# Altium project Grabber_DIOT.PrjPCB (part 2 of 2)

## Sheet EEM_Connectors.SchDoc: Grabber_DIOT
size 420 x 297 mm; DrawnBy: MMroz; Address1: Warsaw Univeristy of Technology; Address2: Nowowiejska 15/19; Revision: 0.1; SheetNumber: 4; SheetTotal: 5; SPICEModelCacheUDDSOIAX: <root> / <DocumentId>UDDSOIAX</DocumentId> / </root>; Title2: EEM_Connectors
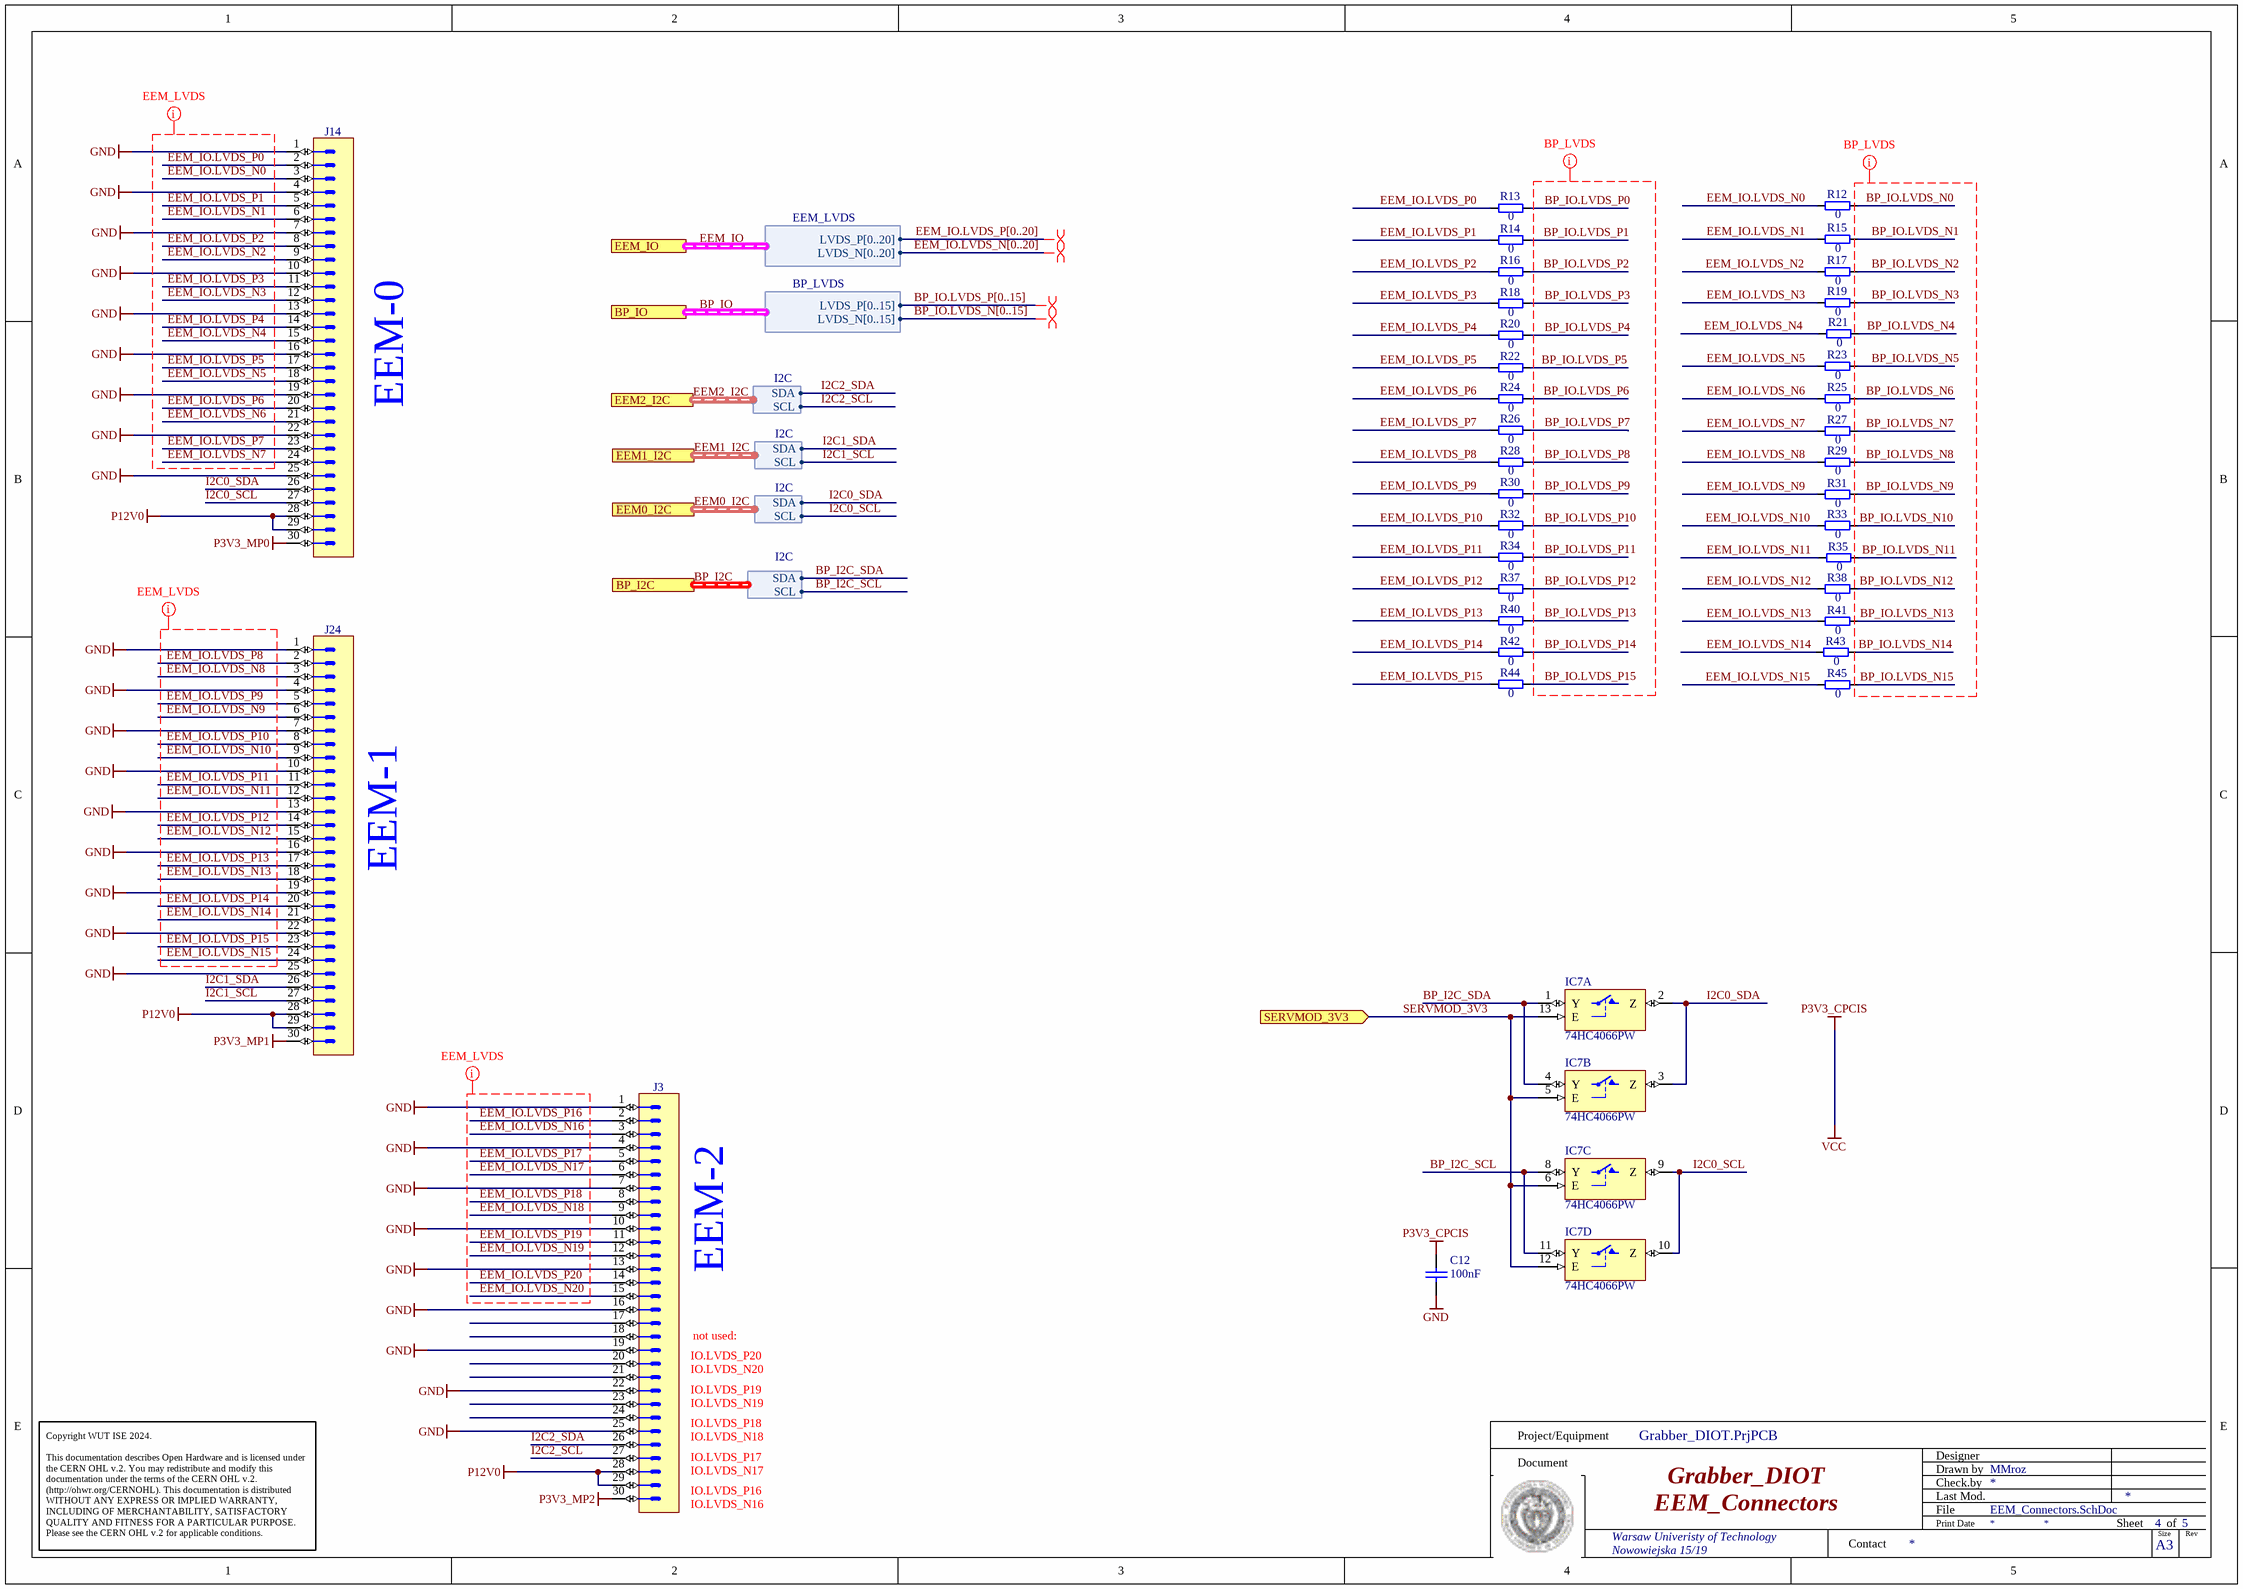
[diagram p4: EEM_Connectors.SchDoc]

### Parts
C12  100nF  [CAPC1608X87N]
IC7  74HC4066PW  [SOP65P640X110-14N]  (parts A,B,C,D of 4)
J3  N2530-6002RB  [3M_N2530-6002RB]  (value not drawn)
J14  N2530-6002RB  [3M_N2530-6002RB]  (value not drawn)
J24  N2530-6002RB  [3M_N2530-6002RB]  (value not drawn)
R12  0  [RESC1005X40N]
R13  0  [RESC1005X40N]
R14  0  [RESC1005X40N]
R15  0  [RESC1005X40N]
R16  0  [RESC1005X40N]
R17  0  [RESC1005X40N]
R18  0  [RESC1005X40N]
R19  0  [RESC1005X40N]
R20  0  [RESC1005X40N]
R21  0  [RESC1005X40N]
R22  0  [RESC1005X40N]
R23  0  [RESC1005X40N]
R24  0  [RESC1005X40N]
R25  0  [RESC1005X40N]
R26  0  [RESC1005X40N]
R27  0  [RESC1005X40N]
R28  0  [RESC1005X40N]
R29  0  [RESC1005X40N]
R30  0  [RESC1005X40N]
R31  0  [RESC1005X40N]
R32  0  [RESC1005X40N]
R33  0  [RESC1005X40N]
R34  0  [RESC1005X40N]
R35  0  [RESC1005X40N]
R37  0  [RESC1005X40N]
R38  0  [RESC1005X40N]
R40  0  [RESC1005X40N]
R41  0  [RESC1005X40N]
R42  0  [RESC1005X40N]
R43  0  [RESC1005X40N]
R44  0  [RESC1005X40N]
R45  0  [RESC1005X40N]

### Ports
BP_I2C (harness I2C), BP_IO (harness BP_LVDS), EEM0_I2C (harness I2C), EEM1_I2C (harness I2C), EEM2_I2C (harness I2C), EEM_IO (harness EEM_LVDS), SERVMOD_3V3 (in)

### Harnesses
EEM_LVDS: LVDS_P[0..20], LVDS_N[0..20]
BP_LVDS: LVDS_P[0..15], LVDS_N[0..15]
I2C: SDA, SCL

### Nets
GND: C12.1 IC7.7(GND) J3.1 J3.4 J3.7 J3.10 J3.13 J3.16 J3.19 J3.22 J3.25 J14.1 J14.4 J14.7 J14.10 J14.13 J14.16 J14.19 J14.22 J14.25 J24.1 J24.4 J24.7 J24.10 J24.13 J24.16 J24.19 J24.22 J24.25
P3V3_CPCIS: C12.2 IC7.14(VCC)  [also labelled VCC]
P3V3_MP0: J14.30
P3V3_MP1: J24.30
P3V3_MP2: J3.30
P12V0: J3.28 J3.29 J14.28 J14.29 J24.28 J24.29
BP_I2C_SCL: IC7.8(Y) IC7.11(Y) ; port BP_I2C.SCL  [project net BP_I2C.SCL]
BP_I2C_SDA: IC7.1(Y) IC7.4(Y) ; port BP_I2C.SDA  [project net BP_I2C.SDA]
BP_IO.LVDS_N0: R12.2
BP_IO.LVDS_N1: R15.2
BP_IO.LVDS_N2: R17.2
BP_IO.LVDS_N3: R19.2
BP_IO.LVDS_N4: R21.2
BP_IO.LVDS_N5: R23.2
BP_IO.LVDS_N6: R25.2
BP_IO.LVDS_N7: R27.2
BP_IO.LVDS_N8: R29.2
BP_IO.LVDS_N9: R31.2
BP_IO.LVDS_N10: R33.2
BP_IO.LVDS_N11: R35.2
BP_IO.LVDS_N12: R38.2
BP_IO.LVDS_N13: R41.2
BP_IO.LVDS_N14: R43.2
BP_IO.LVDS_N15: R45.2
BP_IO.LVDS_P0: R13.2
BP_IO.LVDS_P1: R14.2
BP_IO.LVDS_P2: R16.2
BP_IO.LVDS_P3: R18.2
BP_IO.LVDS_P4: R20.2
BP_IO.LVDS_P5: R22.2
BP_IO.LVDS_P6: R24.2
BP_IO.LVDS_P7: R26.2
BP_IO.LVDS_P8: R28.2
BP_IO.LVDS_P9: R30.2
BP_IO.LVDS_P10: R32.2
BP_IO.LVDS_P11: R34.2
BP_IO.LVDS_P12: R37.2
BP_IO.LVDS_P13: R40.2
BP_IO.LVDS_P14: R42.2
BP_IO.LVDS_P15: R44.2
EEM_IO.LVDS_N0: J14.3 R12.1
EEM_IO.LVDS_N1: J14.6 R15.1
EEM_IO.LVDS_N2: J14.9 R17.1
EEM_IO.LVDS_N3: J14.12 R19.1
EEM_IO.LVDS_N4: J14.15 R21.1
EEM_IO.LVDS_N5: J14.18 R23.1
EEM_IO.LVDS_N6: J14.21 R25.1
EEM_IO.LVDS_N7: J14.24 R27.1
EEM_IO.LVDS_N8: J24.3 R29.1
EEM_IO.LVDS_N9: J24.6 R31.1
EEM_IO.LVDS_N10: J24.9 R33.1
EEM_IO.LVDS_N11: J24.12 R35.1
EEM_IO.LVDS_N12: J24.15 R38.1
EEM_IO.LVDS_N13: J24.18 R41.1
EEM_IO.LVDS_N14: J24.21 R43.1
EEM_IO.LVDS_N15: J24.24 R45.1
EEM_IO.LVDS_N16: J3.3
EEM_IO.LVDS_N17: J3.6
EEM_IO.LVDS_N18: J3.9
EEM_IO.LVDS_N19: J3.12
EEM_IO.LVDS_N20: J3.15
EEM_IO.LVDS_P0: J14.2 R13.1
EEM_IO.LVDS_P1: J14.5 R14.1
EEM_IO.LVDS_P2: J14.8 R16.1
EEM_IO.LVDS_P3: J14.11 R18.1
EEM_IO.LVDS_P4: J14.14 R20.1
EEM_IO.LVDS_P5: J14.17 R22.1
EEM_IO.LVDS_P6: J14.20 R24.1
EEM_IO.LVDS_P7: J14.23 R26.1
EEM_IO.LVDS_P8: J24.2 R28.1
EEM_IO.LVDS_P9: J24.5 R30.1
EEM_IO.LVDS_P10: J24.8 R32.1
EEM_IO.LVDS_P11: J24.11 R34.1
EEM_IO.LVDS_P12: J24.14 R37.1
EEM_IO.LVDS_P13: J24.17 R40.1
EEM_IO.LVDS_P14: J24.20 R42.1
EEM_IO.LVDS_P15: J24.23 R44.1
EEM_IO.LVDS_P16: J3.2
EEM_IO.LVDS_P17: J3.5
EEM_IO.LVDS_P18: J3.8
EEM_IO.LVDS_P19: J3.11
EEM_IO.LVDS_P20: J3.14
I2C0_SCL: IC7.9(Z) IC7.10(Z) J14.27 ; port EEM0_I2C.SCL  [project net EEM0_I2C.SCL]
I2C0_SDA: IC7.2(Z) IC7.3(Z) J14.26 ; port EEM0_I2C.SDA  [project net EEM0_I2C.SDA]
I2C1_SCL: J24.27 ; port EEM1_I2C.SCL  [project net EEM1_I2C.SCL]
I2C1_SDA: J24.26 ; port EEM1_I2C.SDA  [project net EEM1_I2C.SDA]
I2C2_SCL: J3.27 ; port EEM2_I2C.SCL  [project net EEM2_I2C.SCL]
I2C2_SDA: J3.26 ; port EEM2_I2C.SDA  [project net EEM2_I2C.SDA]
SERVMOD_3V3: IC7.5(E) IC7.6(E) IC7.12(E) IC7.13(E) ; port SERVMOD_3V3

Not connected (* = marked no-connect by the designer): J3 17 18 20 21 23 24

### Buses and harness runs
bus BP_IO.LVDS_N[0..15]
bus BP_IO.LVDS_P[0..15]
bus EEM_IO.LVDS_N[0..20]
bus EEM_IO.LVDS_P[0..20]
harness BP_I2C = port BP_I2C
harness BP_IO = port BP_IO
harness EEM0_I2C = port EEM0_I2C
harness EEM1_I2C = port EEM1_I2C
harness EEM2_I2C = port EEM2_I2C
harness EEM_IO = port EEM_IO

### Layout directives
differential pair; differential pair class Diff_100Ohm: (no net found under the mark)
net class EEM_LVDS: EEM_IO.LVDS_N0, EEM_IO.LVDS_N1, EEM_IO.LVDS_N2, EEM_IO.LVDS_N3, EEM_IO.LVDS_N4, EEM_IO.LVDS_N5, EEM_IO.LVDS_N6, EEM_IO.LVDS_N7, EEM_IO.LVDS_N8, EEM_IO.LVDS_N9, EEM_IO.LVDS_N10, EEM_IO.LVDS_N11, EEM_IO.LVDS_N12, EEM_IO.LVDS_N13, EEM_IO.LVDS_N14, EEM_IO.LVDS_N15, EEM_IO.LVDS_N16, EEM_IO.LVDS_N17, EEM_IO.LVDS_N18, EEM_IO.LVDS_N19, EEM_IO.LVDS_N20, EEM_IO.LVDS_P0, EEM_IO.LVDS_P1, EEM_IO.LVDS_P2, EEM_IO.LVDS_P3, EEM_IO.LVDS_P4, EEM_IO.LVDS_P5, EEM_IO.LVDS_P6, EEM_IO.LVDS_P7, EEM_IO.LVDS_P8, EEM_IO.LVDS_P9, EEM_IO.LVDS_P10, EEM_IO.LVDS_P11, EEM_IO.LVDS_P12, EEM_IO.LVDS_P13, EEM_IO.LVDS_P14, EEM_IO.LVDS_P15, EEM_IO.LVDS_P16, EEM_IO.LVDS_P17, EEM_IO.LVDS_P18, EEM_IO.LVDS_P19, EEM_IO.LVDS_P20
net class BP_LVDS: BP_IO.LVDS_N0, BP_IO.LVDS_N1, BP_IO.LVDS_N2, BP_IO.LVDS_N3, BP_IO.LVDS_N4, BP_IO.LVDS_N5, BP_IO.LVDS_N6, BP_IO.LVDS_N7, BP_IO.LVDS_N8, BP_IO.LVDS_N9, BP_IO.LVDS_N10, BP_IO.LVDS_N11, BP_IO.LVDS_N12, BP_IO.LVDS_N13, BP_IO.LVDS_N14, BP_IO.LVDS_N15, BP_IO.LVDS_P0, BP_IO.LVDS_P1, BP_IO.LVDS_P2, BP_IO.LVDS_P3, BP_IO.LVDS_P4, BP_IO.LVDS_P5, BP_IO.LVDS_P6, BP_IO.LVDS_P7, BP_IO.LVDS_P8, BP_IO.LVDS_P9, BP_IO.LVDS_P10, BP_IO.LVDS_P11, BP_IO.LVDS_P12, BP_IO.LVDS_P13, BP_IO.LVDS_P14, BP_IO.LVDS_P15

### Notes on the sheet
- (near J14) EEM-0
- (near J24) EEM-1
- (near J3) EEM-2
- not used:
- (near J3) IO.LVDS_P20
- (near J3) IO.LVDS_N20
- (near J3) IO.LVDS_P19
- (near J3) IO.LVDS_N19
- (near J3) IO.LVDS_P18
- (near J3) IO.LVDS_N18
- (near J3) IO.LVDS_P17
- (near J3) IO.LVDS_N17
- (near J3) IO.LVDS_P16
- (near J3) IO.LVDS_N16
- Project/Equipment
- Document
- Designer
- Drawn by
- Check.by
- Copyright WUT ISE 2024.
  This documentation describes Open Hardware and is licensed under the CERN OHL v.2. You may redistribute and modify this documentation under the terms of the CERN OHL v.2. (http://ohwr.org/CERNOHL). This documentation is distributed WITHOUT ANY EXPRESS OR IMPLIED WARRANTY, INCLUDING OF MERCHANTABILITY, SATISFACTORY QUALITY AND FITNESS FOR A PARTICULAR PURPOSE. Please see the CERN OHL v.2 for applicable conditions.
- Contact
- File
- Last Mod.
- Print Date
- Sheet
- Size
- A3
- of
- Rev

### Library data of the parts
C12 = CC0603_100NF_50V_10%_X7R: Non-polarised capacitor; Part Description: SMD Multilayer Chip Ceramic Capacitor; Manufacturer: GENERIC; Manufacturer1 Part Number: 223858615649; Voltage: 50V; TC: X7R; Tolerance: ±10%; Part Number: CC0603_100NF_50V_10%_X7R; Component Kind: Standard; Component Type: Standard; Pin Count: 2; Value: 100nF; Status: Preferred; Manufacturer Part Number: CC0603_100NF_50V_10%_X7R; Case: 0603; Mounted: Yes; Socket: No; SMD: Yes; Sense: No; Manufacturer1 Example: PHYCOMP; Manufacturer1 ComponentHeight: 0.87mm; HelpURL: \\cern.ch\dfs\Applications\Altium\Datasheets\CC0603_X7R_PHYCOMP.pdf; Author: CERN DEM JLC; CreateDate: 03.12.2007; LatestRevisionDate: 03.12.2007
IC7 = 74HC4066PW: Part Description: Quad Single-Pole Single-Throw Analog Switch; Manufacturer: NXP SEMICONDUCTORS; PressFit: No; Bonding: No; Part Number: 74HC4066PW; Component Kind: Standard; Component Type: Standard; Device: 74HC4066PW; PackageDescription: SOP, 0.65mm Pitch; 14 Pin, 4.40mm W X 5.00mm L X 1.20mm H body, IPC Medium Density; Manufacturer Part Number: 74HC4066PW; Pin Count: 14; Case: TSSOP14; Mounted: Yes; Socket: No; SMD: Yes; Sense: No; ComponentHeight: 1.1mm; Author: CERN DEM JLC; HelpURL: \\cern.ch\dfs\Applications\Altium\Datasheets\74HC4066PW.pdf; CreateDate: 19.11.2014; LatestRevisionDate: 19.11.2014
J3 J14 J24 = 3M_N2530-6002RB: 30 Contacts - Straight .100'' x .100'' Low Profile Four-Wall Header, 2500 Series; Manufacturer: 3M; PressFit: No; Part Number: 3M_N2530-6002RB; Component Kind: Standard; Component Type: Standard; Pin Count: 30; Family: Header 30; Mounted: Yes; Socket: No; SMD: No; Sense: No; Status: None; Part Description: 30 Contacts - Straight .100'' x .100'' Low Profile Four-Wall Header, 2500 Series; Manufacturer Part Number: N2530-6002RB; ComponentHeight: 10.03mm; HelpURL: \\cern.ch\dfs\Applications\Altium\Datasheets\3M_N2530-6002RB.pdf; Author: CERN DEM JLC; CreateDate: 11.02.2009; LatestRevisionDate: 11.08.2009
R12-R35 R37 R38 R40-R45 = R0402_0R_JUMPER: Resistor; Part Description: 1A (0.05R Max DC Resistance) Zero Ohm Jumper; Manufacturer: GENERIC; Manufacturer1 Part Number: 232270591001L; Part Number: R0402_0R_JUMPER; Component Kind: Standard; Component Type: Standard; Pin Count: 2; Value: 0; Status: Not recommended; Manufacturer Part Number: R0402_0R_JUMPER; Case: 0402; Mounted: Yes; Sense: No; Socket: No; SMD: Yes; Manufacturer1 Example: YAGEO PHYCOMP; Manufacturer1 ComponentHeight: 0.4mm; HelpURL: \\cern.ch\dfs\Applications\Altium\Datasheets\R0402_Phycomp_RC0402.pdf; Author: CERN DEM JLC; CreateDate: 03.12.2007; LatestRevisionDate: 17.10.2012

## Sheet Supply.SchDoc
size A4
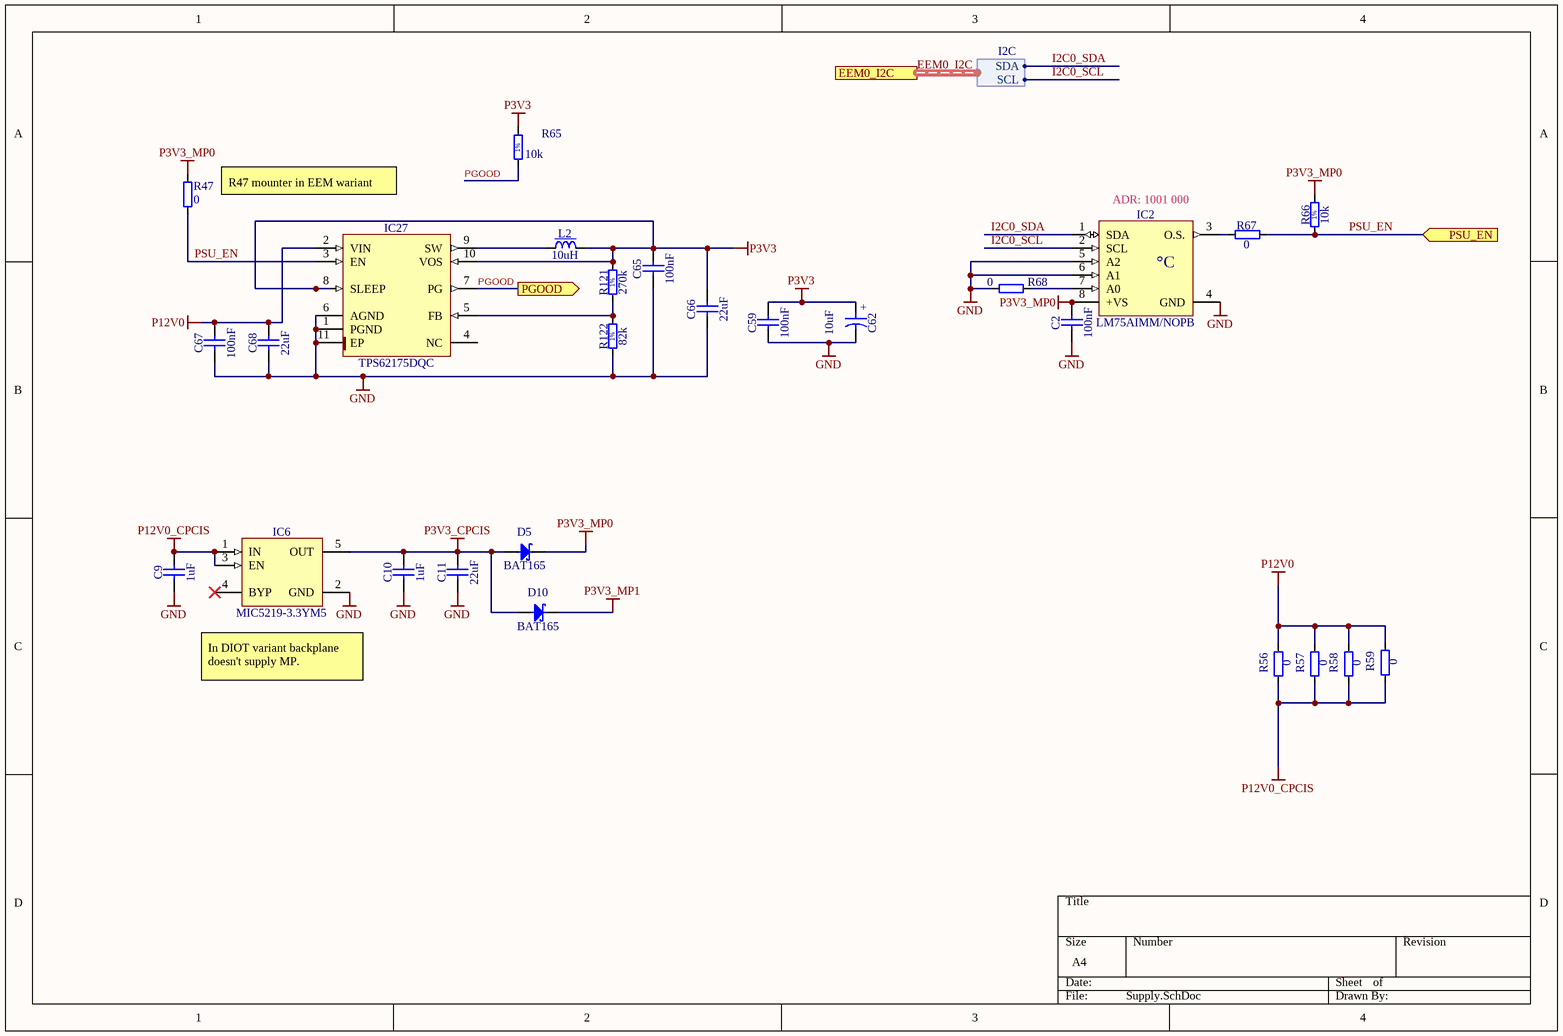
[diagram p5: Supply.SchDoc]

### Parts
C2  100nF  [CAPC1005X55N]
C9  1uF  [CAPC1608X87N]
C10  1uF  [CAPC1608X87N]
C11  22uF  [CAPC1608X90N]
C59  100nF  [CAPC1005X55N]
C62  10uF  [CAPAE430X540N]
C65  100nF  [CAPC1005X55N]
C66  22uF  [CAPC2012X135N]
C67  100nF  [CAPC1005X55N]
C68  22uF  [CAPC2012X135N]
D5  BAT165  [SOD2512X110N]
D10  BAT165  [SOD2512X110N]
IC2  LM75AIMM/NOPB  [SOP65P490X109-8N]
IC6  MIC5219-3.3YM5  [SOT95P280X145-5N]
IC27  TPS62175DQC  [SON50P200X300X80-11N-R94X250]
L2  10uH  [IND_MURATA-PS_8400]
R47  0  [RESC1005X40N]
R56  0  [RESC1005X35N]
R57  0  [RESC1005X35N]
R58  0  [RESC1005X35N]
R59  0  [RESC1005X35N]
R65  10k  [RESC1005X40N]
R66  10k  [RESC1005X40N]
R67  0  [RESC1005X35N]
R68  0  [RESC1005X35N]
R121  270k  [RESC1608X55N]
R122  82k  [RESC1608X55N]

### Ports
EEM0_I2C (harness I2C), PGOOD (out), PSU_EN (in)

### Harnesses
I2C: SDA, SCL

### Nets
GND: C2.1 C9.1 C10.1 C11.1 C59.1 C62.2 C65.1 C66.1 C67.1 C68.1 IC2.4(GND) IC2.5(A2) IC2.6(A1) IC6.2(GND) IC27.1(PGND) IC27.6(AGND) IC27.11(EP) R68.1 R122.1
P3V3: C59.2 C62.1 C65.2 C66.2 IC27.8(SLEEP) IC27.10(VOS) L2.2 R65.2 R121.2
P3V3_CPCIS: C10.2 C11.2 D5.2(A) D10.2(A) IC6.5(OUT)
P3V3_MP0: C2.2 D5.1(C) IC2.8(+VS) R47.2 R66.2
P3V3_MP1: D10.1(C)
P12V0: C67.2 C68.2 IC27.2(VIN) R56.1 R57.1 R58.1 R59.1
P12V0_CPCIS: C9.2 IC6.1(IN) IC6.3(EN) R56.2 R57.2 R58.2 R59.2
I2C0_SCL: IC2.2(SCL) ; port EEM0_I2C.SCL  [project net EEM0_I2C.SCL]
I2C0_SDA: IC2.1(SDA) ; port EEM0_I2C.SDA  [project net EEM0_I2C.SDA]
PGOOD: IC27.7(PG) R65.1 ; port PGOOD
PSU_EN: IC27.3(EN) R47.1 R66.1 R67.2 ; port PSU_EN
NetIC2_3: IC2.3(O.S.) R67.1
NetIC2_7: IC2.7(A0) R68.2
NetIC27_5: IC27.5(FB) R121.1 R122.2
NetIC27_9: IC27.9(SW) L2.1

Not connected (* = marked no-connect by the designer): IC6 4(BYP)*; IC27 4(NC)

### Buses and harness runs
harness EEM0_I2C = port EEM0_I2C

### Notes on the sheet
- R47 mounter in EEM wariant
- (near IC2) ADR: 1001 000
- In DIOT variant backplane doesn't supply MP.
- (in symbol CAE430-540_10UF_16V_20%) +
- (in symbol LM75AIMM/NOPB) °C
- (in symbol R0402_10K_1%_0.0625W_100PPM) 1%
- (in symbol R0603_82K_1%_0.1W_100PPM) 1%
- (in symbol R0603_270K_1%_0.1W_100PPM) 1%

### Library data of the parts
C2 C59 C65 C67 = CC0402_100NF_16V_10%_X5R: Non-polarised capacitor; Part Description: SMD Multilayer Chip Ceramic Capacitor; Manufacturer: GENERIC; Manufacturer1 Part Number: GRM155R61C104KA88D; Voltage: 16V; TC: X5R; Tolerance: ±10%; Part Number: CC0402_100NF_16V_10%_X5R; Component Kind: Standard; Component Type: Standard; Pin Count: 2; Value: 100nF; Status: None; Manufacturer Part Number: CC0402_100NF_16V_10%_X5R; Case: 0402; Mounted: Yes; Socket: No; SMD: Yes; Sense: No; Manufacturer1 Example: MURATA; Manufacturer1 ComponentHeight: 0.55mm; HelpURL: \\cern.ch\dfs\Applications\Altium\Datasheets\CC0402_X5R_MURATA_GRM.pdf; Author: CERN DEM JLC; CreateDate: 10.12.2013; LatestRevisionDate: 10.12.2013
C9 C10 = CC0603_1UF_25V_10%_X7R: Non-polarised capacitor; Part Description: SMD Multilayer Chip Ceramic Capacitor; Manufacturer: GENERIC; Manufacturer1 Part Number: GRM188R71E105KA12D; Voltage: 25V; TC: X7R; Tolerance: ±10%; Part Number: CC0603_1UF_25V_10%_X7R; Component Kind: Standard; Component Type: Standard; Pin Count: 2; Value: 1uF; Status: None; Manufacturer Part Number: CC0603_1UF_25V_10%_X7R; Case: 0603; Mounted: Yes; Socket: No; SMD: Yes; Sense: No; Manufacturer1 Example: MURATA; Manufacturer1 ComponentHeight: 0.9mm; HelpURL: \\cern.ch\dfs\Applications\Altium\Datasheets\CC0603_X7R_MURATA.pdf; Author: CERN DEM JLC; CreateDate: 18.01.2011; LatestRevisionDate: 18.01.2011
C11 = CC0603_22UF_6.3V_20%_X5R: Non-polarised capacitor; Part Description: SMD Multilayer Chip Ceramic Capacitor; Manufacturer: GENERIC; Manufacturer1 Part Number: C1608X5R0J226M080; Voltage: 6.3V; TC: X5R; Tolerance: ±20%; Part Number: CC0603_22UF_6.3V_20%_X5R; Component Kind: Standard; Component Type: Standard; Pin Count: 2; Value: 22uF; Status: None; Manufacturer Part Number: CC0603_22UF_6.3V_20%_X5R; Case: 0603; Mounted: Yes; Socket: No; SMD: Yes; Sense: No; Manufacturer1 Example: TDK; Manufacturer1 ComponentHeight: 0.9mm; HelpURL: \\cern.ch\dfs\Applications\Altium\Datasheets\CC0603_X5R_TDK_C.pdf; Author: CERN DEM JLC; CreateDate: 16.12.2013; LatestRevisionDate: 03.12.2020
C62 = CAE430-540_10UF_16V_20%: Polarised capacitor; Part Description: Aluminum Electrolytic SMT Capacitor; Manufacturer: PANASONIC; Manufacturer Part Number: EEEFK1C100AR; Voltage: 16V; Tolerance: ±20%; Part Number: CAE430-540_10UF_16V_20%; Component Kind: Standard; Component Type: Standard; Pin Count: 2; Value: 10uF; Status: Not Recommended; Case: B; Mounted: Yes; Socket: No; SMD: Yes; Sense: No; ComponentHeight: 5.8mm; HelpURL: \\cern.ch\dfs\Applications\Altium\Datasheets\CAE_PANASONIC_FK.pdf; Author: CERN DEM JLC; CreateDate: 03.12.2007; LatestRevisionDate: 05.11.2014
C66 C68 = CC0805_22UF_16V_10%_X5R: Non-polarised capacitor; Part Description: SMD Multilayer Chip Ceramic Capacitor; Manufacturer: GENERIC; Manufacturer1 Part Number: C2012X5R1C226KT; Voltage: 16V; TC: X5R; Tolerance: ±10%; Part Number: CC0805_22UF_16V_10%_X5R; Component Kind: Standard; Component Type: Standard; Pin Count: 2; Value: 22uF; Status: Preferred; Manufacturer Part Number: CC0805_22UF_16V_10%_X5R; Case: 0805; Mounted: Yes; Socket: No; SMD: Yes; Sense: No; Manufacturer1 Example: TDK; Manufacturer1 ComponentHeight: 1.35mm; HelpURL: \\cern.ch\dfs\Applications\Altium\Datasheets\CC0805_X5R_TDK_C.pdf; Author: CERN DEM JLC; CreateDate: 25.10.2012; LatestRevisionDate: 25.10.2012
D5 D10 = BAT165: Schottky Diode; Manufacturer: INFINEON; Part Description: Medium Power AF Schottky Diode; Voltage: 40V; Power: 750mA; PressFit: No; Bonding: No; Manufacturer Part Number: BAT165; PackageDescription: Small Outline Diode (SOD-323), 1.70mm W X 1.25mm L X 1.10mm H body,  IPC Medium Density; Part Number: BAT165; Component Kind: Standard; Component Type: Standard; Device: BAT165; Pin Count: 2; Case: SOD323; Mounted: Yes; Socket: No; SMD: Yes; Sense: No; ComponentHeight: 1.1mm; HelpURL: \\cern.ch\dfs\Applications\Altium\Datasheets\BAT165.pdf; Author: CERN DEM JLC; CreateDate: 12.11.2014; LatestRevisionDate: 12.11.2014
IC2 = LM75AIMM/NOPB: Digital Temperature Sensor and Thermal Watchdog with Two-Wire Interface; Part Description: -25° to +100°C ±2°C Digital Temperature Sensor and Thermal Watchdog with Two-Wire Interface; Manufacturer: TEXAS INSTRUMENTS; PressFit: No; Bonding: No; Part Number: LM75AIMM/NOPB; Component Kind: Standard; Component Type: Standard; Device: LM75AIMM/NOPB; PackageDescription: SOP, 0.65mm pitch; 8 pin,3.00mm W X 3.00mm L X 1.09mm H bodyI, PC Medium Density; Manufacturer Part Number: LM75AIMM/NOPB; Pin Count: 8; Case: SSOP8; Mounted: Yes; Socket: No; SMD: Yes; Sense: No; ComponentHeight: 1.09mm; HelpURL: \\cern.ch\dfs\Applications\Altium\Datasheets\LM75AIMM-NOPB.pdf; Author: CERN DEM JLC; CreateDate: 15.10.2012; LatestRevisionDate: 15.10.2012
IC6 = MIC5219-3.3YM5: 500mA Peak Output LDO Regulator; Part Description: 3.3V 500mA Peak Output Low Drop-Out  (LDO) Regulator; Manufacturer: MICROCHIP TECHNOLOGY; PressFit: No; Bonding: No; Part Number: MIC5219-3.3YM5; Component Kind: Standard; Component Type: Standard; Device: MIC5219-3.3YM5; PackageDescription: SOT, 0.95mm pitch; 5 pin, 1.60mm W X 2.90mm L X 1.45mm H body, IPC Medium Density; Manufacturer Part Number: MIC5219-3.3YM5; Pin Count: 5; Case: SOT23-5; Mounted: Yes; Socket: No; SMD: Yes; Sense: No; ComponentHeight: 1.45mm; HelpURL: \\cern.ch\dfs\Applications\Altium\Datasheets\MIC5219-3.3YM5.pdf; Author: CERN DEM WB; CreateDate: 2019-04-16; LatestRevisionDate: 2019-04-16
IC27 = TPS62175DQC: 4.75-28VDC to 1-6VDC, 500mA Step-Down Converter With Sleep Mode; Manufacturer: TEXAS INSTRUMENTS; PressFit: No; Bonding: No; Part Number: TPS62175DQC; Component Kind: Standard; Component Type: Standard; Device: TPS62175DQC; PackageDescription: SON, 10-Leads, Body 2x3mm, Pitch 0.5mm, Thermal Pad 0.94x2.5mm, IPC Medium Density; Part Description: 4.75-28VDC to 1-6VDC, 500mA Step-Down Converter With Sleep Mode; Manufacturer Part Number: TPS62175DQC; Pin Count: 11; Case: SON10; Mounted: Yes; Socket: No; SMD: Yes; Sense: No; ComponentHeight: 0.8mm; HelpURL: \\cern.ch\dfs\Applications\Altium\Datasheets\TPS62175DQC.pdf; Author: CERN DEM JMW; CreateDate: 11.08.2015; LatestRevisionDate: 11.08.2015
L2 = IND_10UH_10%_MURATA-PS_8400: Inductor With Core; Part Description: Miniature Surface Mount Power Inductor (8400 Serie); Manufacturer: MURATA POWER SOLUTIONS; Manufacturer Part Number: 84103C; Power: 950mA; Resistance: 0.24R; Tolerance: ±10%; Part Number: IND_10UH_10%_MURATA-PS_8400; Component Kind: Standard; Component Type: Standard; Pin Count: 2; Value: 10uH; Status: None; Mounted: Yes; Socket: No; SMD: Yes; Sense: No; ComponentHeight: 2.9mm; HelpURL: \\cern.ch\dfs\Applications\Altium\Datasheets\IND_MURATA-PS_8400.pdf; Author: CERN DEM JLC; CreateDate: 02.07.2012; LatestRevisionDate: 02.07.2012
R47 R67 R68 = R0402_0R_JUMPER: as R12 on sheet EEM_Connectors; Part Number: R0402_0R_JUMPER; Component Kind: Standard; Component Type: Standard; Pin Count: 2; Value: 0; Status: Not recommended; Manufacturer Part Number: R0402_0R_JUMPER; Case: 0402; Mounted: Yes; Sense: No; Socket: No; SMD: Yes; Manufacturer1 Example: YAGEO PHYCOMP; Manufacturer1 ComponentHeight: 0.4mm; HelpURL: \\cern.ch\dfs\Applications\Altium\Datasheets\R0402_Phycomp_RC0402.pdf; Author: CERN DEM JLC; CreateDate: 03.12.2007; LatestRevisionDate: 17.10.2012
  R67 R68: Footprint: RESC1005X40N
R56-R59 = R0603_0R_JUMPER: Resistor; Part Description: 1A (0.05R Max DC Resistance) Zero Ohm Jumper; Manufacturer: GENERIC; Manufacturer1 Part Number: NRC06Z0; PressFit: No; Part Number: R0603_0R_JUMPER; Component Kind: Standard; Component Type: Standard; Footprint: RESC1608X55N; Pin Count: 2; Value: 0; Status: Preferred; Manufacturer Part Number: R0603_0R_JUMPER; Case: 0603; Mounted: Yes; Sense: No; Socket: No; SMD: Yes; Manufacturer1 Example: NIC COMPONENT; Manufacturer1 ComponentHeight: 0.55mm; HelpURL: \\cern.ch\dfs\Applications\Altium\Datasheets\R0603_NIC_NRC.pdf; Author: CERN DEM JLC; CreateDate: 03.12.2007; LatestRevisionDate: 13.03.2008
R65 = R0402_10K_1%_0.0625W_100PPM: as R1 on sheet Grabber_DIOT; Part Number: R0402_10K_1%_0.0625W_100PPM; Component Kind: Standard; Component Type: Standard; Pin Count: 2; Value: 10k; Status: Not recommended; Power: 0.0625W; Tolerance: ±1%; Manufacturer Part Number: R0402_10K_1%_0.0625W_100PPM; Case: 0402; Mounted: Yes; Sense: No; Socket: No; SMD: Yes; Manufacturer1 Example: YAGEO PHYCOMP; Manufacturer1 ComponentHeight: 0.4mm; HelpURL: \\cern.ch\dfs\Applications\Altium\Datasheets\R0402_Phycomp_RC0402.pdf; Author: CERN DEM JLC; CreateDate: 03.12.2007; LatestRevisionDate: 17.10.2012
R66 = R0402_10K_1%_0.0625W_100PPM: Resistor - 1%; Part Description: General Purpose Thick Film Chip Resistor; Manufacturer: GENERIC; Manufacturer1 Part Number: 232270671003L; TC: ±100ppm/°C; PressFit: No; Part Number: R0402_10K_1%_0.0625W_100PPM; Component Kind: Standard; Component Type: Standard; Pin Count: 2; Value: 10k; Status: Not Recommended; Power: 0.0625W; Tolerance: ±1%; Manufacturer Part Number: R0402_10K_1%_0.0625W_100PPM; Case: 0402; Mounted: Yes; Sense: No; Socket: No; SMD: Yes; Manufacturer1 Example: YAGEO PHYCOMP; Manufacturer1 ComponentHeight: 0.4mm; HelpURL: \\cern.ch\dfs\Applications\Altium\Datasheets\R0402_Phycomp_RC0402.pdf; Author: CERN DEM JLC; CreateDate: 03.12.2007; LatestRevisionDate: 17.10.2012
R121 = R0603_270K_1%_0.1W_100PPM: Resistor - 1%; Part Description: General Purpose Thick Film Chip Resistor; Manufacturer: GENERIC; Manufacturer1 Part Number: NRC06F2703TRF; Power: 0.1W; TC: ±100ppm/°C; Part Number: R0603_270K_1%_0.1W_100PPM; Component Kind: Standard; Component Type: Standard; Pin Count: 2; Value: 270k; Status: Preferred; Tolerance: ±1%; Manufacturer Part Number: R0603_270K_1%_0.1W_100PPM; Case: 0603; Mounted: Yes; Sense: No; Socket: No; SMD: Yes; Manufacturer1 Example: NIC COMPONENT; Manufacturer1 ComponentHeight: 0.55mm; HelpURL: \\cern.ch\dfs\Applications\Altium\Datasheets\R0603_NIC_NRC.pdf; Author: CERN DEM JLC; CreateDate: 03.12.2007; LatestRevisionDate: 13.03.2008
R122 = R0603_82K_1%_0.1W_100PPM: Resistor - 1%; Part Description: General Purpose Thick Film Chip Resistor; Manufacturer: GENERIC; Manufacturer1 Part Number: NRC06F8202TRF; Power: 0.1W; TC: ±100ppm/°C; Part Number: R0603_82K_1%_0.1W_100PPM; Component Kind: Standard; Component Type: Standard; Pin Count: 2; Value: 82k; Status: Preferred; Tolerance: ±1%; Manufacturer Part Number: R0603_82K_1%_0.1W_100PPM; Case: 0603; Mounted: Yes; Sense: No; Socket: No; SMD: Yes; Manufacturer1 Example: NIC COMPONENT; Manufacturer1 ComponentHeight: 0.55mm; HelpURL: \\cern.ch\dfs\Applications\Altium\Datasheets\R0603_NIC_NRC.pdf; Author: CERN DEM JLC; CreateDate: 03.12.2007; LatestRevisionDate: 13.03.2008

## Nets that join several sheets
GND: Grabber_DIOT_TOP (C1.2 R5.2 R6.2), Grabber_DIOT (29 pins), U_Grabber_DIOT/U_LVDS_repeater (C47U.1 D1U.2 IC20U.2 IC20U.4), U_Grabber_DIOT/U_LVDS_repeater (C47T.1 D1T.2 IC20T.2 IC20T.4), U_Grabber_DIOT/U_LVDS_repeater (C47S.1 D1S.2 IC20S.2 IC20S.4), U_Grabber_DIOT/U_LVDS_repeater (C47R.1 D1R.2 IC20R.2 IC20R.4), U_Grabber_DIOT/U_LVDS_repeater (C47Q.1 D1Q.2 IC20Q.2 IC20Q.4), U_Grabber_DIOT/U_LVDS_repeater (C47P.1 D1P.2 IC20P.2 IC20P.4), U_Grabber_DIOT/U_LVDS_repeater (C47O.1 D1O.2 IC20O.2 IC20O.4), U_Grabber_DIOT/U_LVDS_repeater (C47N.1 D1N.2 IC20N.2 IC20N.4), U_Grabber_DIOT/U_LVDS_repeater (C47M.1 D1M.2 IC20M.2 IC20M.4), U_Grabber_DIOT/U_LVDS_repeater (C47L.1 D1L.2 IC20L.2 IC20L.4), U_Grabber_DIOT/U_LVDS_repeater (C47K.1 D1K.2 IC20K.2 IC20K.4), U_Grabber_DIOT/U_LVDS_repeater (C47J.1 D1J.2 IC20J.2 IC20J.4), U_Grabber_DIOT/U_LVDS_repeater (C47I.1 D1I.2 IC20I.2 IC20I.4), U_Grabber_DIOT/U_LVDS_repeater (C47H.1 D1H.2 IC20H.2 IC20H.4), U_Grabber_DIOT/U_LVDS_repeater (C47G.1 D1G.2 IC20G.2 IC20G.4), U_Grabber_DIOT/U_LVDS_repeater (C47F.1 D1F.2 IC20F.2 IC20F.4), U_Grabber_DIOT/U_LVDS_repeater (C47E.1 D1E.2 IC20E.2 IC20E.4), U_Grabber_DIOT/U_LVDS_repeater (C47D.1 D1D.2 IC20D.2 IC20D.4), U_Grabber_DIOT/U_LVDS_repeater (C47C.1 D1C.2 IC20C.2 IC20C.4), U_Grabber_DIOT/U_LVDS_repeater (C47B.1 D1B.2 IC20B.2 IC20B.4), U_Grabber_DIOT/U_LVDS_repeater (C47A.1 D1A.2 IC20A.2 IC20A.4), CPCIS_Connectors (63 pins), EEM_Connectors (29 pins), Supply (19 pins)
P3V3: Grabber_DIOT (B10.1 R2.1 R8.1 R9.1), U_Grabber_DIOT/U_LVDS_repeater (C47U.2 D1U.5 IC20U.7), U_Grabber_DIOT/U_LVDS_repeater (C47T.2 D1T.5 IC20T.7), U_Grabber_DIOT/U_LVDS_repeater (C47S.2 D1S.5 IC20S.7), U_Grabber_DIOT/U_LVDS_repeater (C47R.2 D1R.5 IC20R.7), U_Grabber_DIOT/U_LVDS_repeater (C47Q.2 D1Q.5 IC20Q.7), U_Grabber_DIOT/U_LVDS_repeater (C47P.2 D1P.5 IC20P.7), U_Grabber_DIOT/U_LVDS_repeater (C47O.2 D1O.5 IC20O.7), U_Grabber_DIOT/U_LVDS_repeater (C47N.2 D1N.5 IC20N.7), U_Grabber_DIOT/U_LVDS_repeater (C47M.2 D1M.5 IC20M.7), U_Grabber_DIOT/U_LVDS_repeater (C47L.2 D1L.5 IC20L.7), U_Grabber_DIOT/U_LVDS_repeater (C47K.2 D1K.5 IC20K.7), U_Grabber_DIOT/U_LVDS_repeater (C47J.2 D1J.5 IC20J.7), U_Grabber_DIOT/U_LVDS_repeater (C47I.2 D1I.5 IC20I.7), U_Grabber_DIOT/U_LVDS_repeater (C47H.2 D1H.5 IC20H.7), U_Grabber_DIOT/U_LVDS_repeater (C47G.2 D1G.5 IC20G.7), U_Grabber_DIOT/U_LVDS_repeater (C47F.2 D1F.5 IC20F.7), U_Grabber_DIOT/U_LVDS_repeater (C47E.2 D1E.5 IC20E.7), U_Grabber_DIOT/U_LVDS_repeater (C47D.2 D1D.5 IC20D.7), U_Grabber_DIOT/U_LVDS_repeater (C47C.2 D1C.5 IC20C.7), U_Grabber_DIOT/U_LVDS_repeater (C47B.2 D1B.5 IC20B.7), U_Grabber_DIOT/U_LVDS_repeater (C47A.2 D1A.5 IC20A.7), Supply (9 pins)
P3V3_CPCIS: CPCIS_Connectors (12 pins), EEM_Connectors (C12.2 IC7.14), Supply (5 pins)
P3V3_MP0: Grabber_DIOT (5 pins), EEM_Connectors (J14.30), Supply (5 pins)
P3V3_MP1: Grabber_DIOT (5 pins), EEM_Connectors (J24.30), Supply (D10.1)
P3V3_MP2: Grabber_DIOT (5 pins), EEM_Connectors (J3.30)
P12V0: Grabber_DIOT (B11.1 R1.2), EEM_Connectors (6 pins), Supply (7 pins)
P12V0_CPCIS: CPCIS_Connectors (7 pins), Supply (7 pins)
BP_I2C.SCL: CPCIS_Connectors (D7.3 J4.B2), EEM_Connectors (IC7.8 IC7.11)
BP_I2C.SDA: CPCIS_Connectors (D7.1 J4.C2), EEM_Connectors (IC7.1 IC7.4)
BP_IO.LVDS_N0: CPCIS_Connectors (J4.E3), EEM_Connectors (R12.2)
BP_IO.LVDS_N1: CPCIS_Connectors (J4.B3), EEM_Connectors (R15.2)
BP_IO.LVDS_N2: CPCIS_Connectors (J4.C4), EEM_Connectors (R17.2)
BP_IO.LVDS_N3: CPCIS_Connectors (J4.L4), EEM_Connectors (R19.2)
BP_IO.LVDS_N4: CPCIS_Connectors (J4.I4), EEM_Connectors (R21.2)
BP_IO.LVDS_N5: CPCIS_Connectors (J4.K5), EEM_Connectors (R23.2)
BP_IO.LVDS_N6: CPCIS_Connectors (J4.H5), EEM_Connectors (R25.2)
BP_IO.LVDS_N7: CPCIS_Connectors (J4.F6), EEM_Connectors (R27.2)
BP_IO.LVDS_N8: CPCIS_Connectors (J4.C6), EEM_Connectors (R29.2)
BP_IO.LVDS_N9: CPCIS_Connectors (J4.L6), EEM_Connectors (R31.2)
BP_IO.LVDS_N10: CPCIS_Connectors (J4.I6), EEM_Connectors (R33.2)
BP_IO.LVDS_N11: CPCIS_Connectors (J5.E1), EEM_Connectors (R35.2)
BP_IO.LVDS_N12: CPCIS_Connectors (J5.B1), EEM_Connectors (R38.2)
BP_IO.LVDS_N13: CPCIS_Connectors (J5.K1), EEM_Connectors (R41.2)
BP_IO.LVDS_N14: CPCIS_Connectors (J5.H1), EEM_Connectors (R43.2)
BP_IO.LVDS_N15: CPCIS_Connectors (J4.F2), EEM_Connectors (R45.2)
BP_IO.LVDS_P0: CPCIS_Connectors (J4.D3), EEM_Connectors (R13.2)
BP_IO.LVDS_P1: CPCIS_Connectors (J4.A3), EEM_Connectors (R14.2)
BP_IO.LVDS_P2: CPCIS_Connectors (J4.B4), EEM_Connectors (R16.2)
BP_IO.LVDS_P3: CPCIS_Connectors (J4.K4), EEM_Connectors (R18.2)
BP_IO.LVDS_P4: CPCIS_Connectors (J4.H4), EEM_Connectors (R20.2)
BP_IO.LVDS_P5: CPCIS_Connectors (J4.J5), EEM_Connectors (R22.2)
BP_IO.LVDS_P6: CPCIS_Connectors (J4.G5), EEM_Connectors (R24.2)
BP_IO.LVDS_P7: CPCIS_Connectors (J4.E6), EEM_Connectors (R26.2)
BP_IO.LVDS_P8: CPCIS_Connectors (J4.B6), EEM_Connectors (R28.2)
BP_IO.LVDS_P9: CPCIS_Connectors (J4.K6), EEM_Connectors (R30.2)
BP_IO.LVDS_P10: CPCIS_Connectors (J4.H6), EEM_Connectors (R32.2)
BP_IO.LVDS_P11: CPCIS_Connectors (J5.D1), EEM_Connectors (R34.2)
BP_IO.LVDS_P12: CPCIS_Connectors (J5.A1), EEM_Connectors (R37.2)
BP_IO.LVDS_P13: CPCIS_Connectors (J5.J1), EEM_Connectors (R40.2)
BP_IO.LVDS_P14: CPCIS_Connectors (J5.G1), EEM_Connectors (R42.2)
BP_IO.LVDS_P15: CPCIS_Connectors (J4.E2), EEM_Connectors (R44.2)
CC0_N: Grabber_DIOT (J1.18), U_Grabber_DIOT/U_LVDS_repeater (D1I.6 IC20I.5)
CC0_P: Grabber_DIOT (J1.5), U_Grabber_DIOT/U_LVDS_repeater (D1I.1 IC20I.6)
CC1_N: Grabber_DIOT (J1.4), U_Grabber_DIOT/U_LVDS_repeater (D1H.6 IC20H.5)
CC1_P: Grabber_DIOT (J1.17), U_Grabber_DIOT/U_LVDS_repeater (D1H.1 IC20H.6)
CC2_N: Grabber_DIOT (J1.16), U_Grabber_DIOT/U_LVDS_repeater (D1G.6 IC20G.5)
CC2_P: Grabber_DIOT (J1.3), U_Grabber_DIOT/U_LVDS_repeater (D1G.1 IC20G.6)
CC3_N: Grabber_DIOT (J1.2), U_Grabber_DIOT/U_LVDS_repeater (D1F.6 IC20F.5)
CC3_P: Grabber_DIOT (J1.15), U_Grabber_DIOT/U_LVDS_repeater (D1F.1 IC20F.6)
EEM0_I2C.SCL: Grabber_DIOT (B2.1 D2.3 IC24.1), EEM_Connectors (IC7.9 IC7.10 J14.27), Supply (IC2.2)
EEM0_I2C.SDA: Grabber_DIOT (B1.1 D2.2 IC24.3), EEM_Connectors (IC7.2 IC7.3 J14.26), Supply (IC2.1)
EEM1_I2C.SCL: Grabber_DIOT (B4.1 D3.3 IC26.1), EEM_Connectors (J24.27)
EEM1_I2C.SDA: Grabber_DIOT (B3.1 D3.2 IC26.3), EEM_Connectors (J24.26)
EEM2_I2C.SCL: Grabber_DIOT (B15.1 D4.3 IC1.1), EEM_Connectors (J3.27)
EEM2_I2C.SDA: Grabber_DIOT (B14.1 D4.2 IC1.3), EEM_Connectors (J3.26)
EEM_IO.LVDS_N0: U_Grabber_DIOT/U_LVDS_repeater (D1U.6 IC20U.5), EEM_Connectors (J14.3 R12.1)
EEM_IO.LVDS_N1: U_Grabber_DIOT/U_LVDS_repeater (D1T.6 IC20T.5), EEM_Connectors (J14.6 R15.1)
EEM_IO.LVDS_N2: U_Grabber_DIOT/U_LVDS_repeater (D1S.6 IC20S.5), EEM_Connectors (J14.9 R17.1)
EEM_IO.LVDS_N3: U_Grabber_DIOT/U_LVDS_repeater (D1R.6 IC20R.5), EEM_Connectors (J14.12 R19.1)
EEM_IO.LVDS_N4: U_Grabber_DIOT/U_LVDS_repeater (D1Q.6 IC20Q.5), EEM_Connectors (J14.15 R21.1)
EEM_IO.LVDS_N5: U_Grabber_DIOT/U_LVDS_repeater (D1I.3 IC20I.1 R131I.1), EEM_Connectors (J14.18 R23.1)
EEM_IO.LVDS_N6: U_Grabber_DIOT/U_LVDS_repeater (D1H.3 IC20H.1 R131H.1), EEM_Connectors (J14.21 R25.1)
EEM_IO.LVDS_N7: U_Grabber_DIOT/U_LVDS_repeater (D1G.3 IC20G.1 R131G.1), EEM_Connectors (J14.24 R27.1)
EEM_IO.LVDS_N8: U_Grabber_DIOT/U_LVDS_repeater (D1P.6 IC20P.5), EEM_Connectors (J24.3 R29.1)
EEM_IO.LVDS_N9: U_Grabber_DIOT/U_LVDS_repeater (D1O.6 IC20O.5), EEM_Connectors (J24.6 R31.1)
EEM_IO.LVDS_N10: U_Grabber_DIOT/U_LVDS_repeater (D1N.6 IC20N.5), EEM_Connectors (J24.9 R33.1)
EEM_IO.LVDS_N11: U_Grabber_DIOT/U_LVDS_repeater (D1M.6 IC20M.5), EEM_Connectors (J24.12 R35.1)
EEM_IO.LVDS_N12: U_Grabber_DIOT/U_LVDS_repeater (D1L.6 IC20L.5), EEM_Connectors (J24.15 R38.1)
EEM_IO.LVDS_N13: U_Grabber_DIOT/U_LVDS_repeater (D1K.6 IC20K.5), EEM_Connectors (J24.18 R41.1)
EEM_IO.LVDS_N14: U_Grabber_DIOT/U_LVDS_repeater (D1J.3 IC20J.1 R131J.1), EEM_Connectors (J24.21 R43.1)
EEM_IO.LVDS_N15: U_Grabber_DIOT/U_LVDS_repeater (D1F.3 IC20F.1 R131F.1), EEM_Connectors (J24.24 R45.1)
EEM_IO.LVDS_N16: U_Grabber_DIOT/U_LVDS_repeater (D1E.6 IC20E.5), EEM_Connectors (J3.3)
EEM_IO.LVDS_N17: U_Grabber_DIOT/U_LVDS_repeater (D1D.6 IC20D.5), EEM_Connectors (J3.6)
EEM_IO.LVDS_N18: U_Grabber_DIOT/U_LVDS_repeater (D1C.6 IC20C.5), EEM_Connectors (J3.9)
EEM_IO.LVDS_N19: U_Grabber_DIOT/U_LVDS_repeater (D1B.6 IC20B.5), EEM_Connectors (J3.12)
EEM_IO.LVDS_N20: U_Grabber_DIOT/U_LVDS_repeater (D1A.6 IC20A.5), EEM_Connectors (J3.15)
EEM_IO.LVDS_P0: U_Grabber_DIOT/U_LVDS_repeater (D1U.1 IC20U.6), EEM_Connectors (J14.2 R13.1)
EEM_IO.LVDS_P1: U_Grabber_DIOT/U_LVDS_repeater (D1T.1 IC20T.6), EEM_Connectors (J14.5 R14.1)
EEM_IO.LVDS_P2: U_Grabber_DIOT/U_LVDS_repeater (D1S.1 IC20S.6), EEM_Connectors (J14.8 R16.1)
EEM_IO.LVDS_P3: U_Grabber_DIOT/U_LVDS_repeater (D1R.1 IC20R.6), EEM_Connectors (J14.11 R18.1)
EEM_IO.LVDS_P4: U_Grabber_DIOT/U_LVDS_repeater (D1Q.1 IC20Q.6), EEM_Connectors (J14.14 R20.1)
EEM_IO.LVDS_P5: U_Grabber_DIOT/U_LVDS_repeater (D1I.4 IC20I.8 R131I.2), EEM_Connectors (J14.17 R22.1)
EEM_IO.LVDS_P6: U_Grabber_DIOT/U_LVDS_repeater (D1H.4 IC20H.8 R131H.2), EEM_Connectors (J14.20 R24.1)
EEM_IO.LVDS_P7: U_Grabber_DIOT/U_LVDS_repeater (D1G.4 IC20G.8 R131G.2), EEM_Connectors (J14.23 R26.1)
EEM_IO.LVDS_P8: U_Grabber_DIOT/U_LVDS_repeater (D1P.1 IC20P.6), EEM_Connectors (J24.2 R28.1)
EEM_IO.LVDS_P9: U_Grabber_DIOT/U_LVDS_repeater (D1O.1 IC20O.6), EEM_Connectors (J24.5 R30.1)
EEM_IO.LVDS_P10: U_Grabber_DIOT/U_LVDS_repeater (D1N.1 IC20N.6), EEM_Connectors (J24.8 R32.1)
EEM_IO.LVDS_P11: U_Grabber_DIOT/U_LVDS_repeater (D1M.1 IC20M.6), EEM_Connectors (J24.11 R34.1)
EEM_IO.LVDS_P12: U_Grabber_DIOT/U_LVDS_repeater (D1L.1 IC20L.6), EEM_Connectors (J24.14 R37.1)
EEM_IO.LVDS_P13: U_Grabber_DIOT/U_LVDS_repeater (D1K.1 IC20K.6), EEM_Connectors (J24.17 R40.1)
EEM_IO.LVDS_P14: U_Grabber_DIOT/U_LVDS_repeater (D1J.4 IC20J.8 R131J.2), EEM_Connectors (J24.20 R42.1)
EEM_IO.LVDS_P15: U_Grabber_DIOT/U_LVDS_repeater (D1F.4 IC20F.8 R131F.2), EEM_Connectors (J24.23 R44.1)
EEM_IO.LVDS_P16: U_Grabber_DIOT/U_LVDS_repeater (D1E.1 IC20E.6), EEM_Connectors (J3.2)
EEM_IO.LVDS_P17: U_Grabber_DIOT/U_LVDS_repeater (D1D.1 IC20D.6), EEM_Connectors (J3.5)
EEM_IO.LVDS_P18: U_Grabber_DIOT/U_LVDS_repeater (D1C.1 IC20C.6), EEM_Connectors (J3.8)
EEM_IO.LVDS_P19: U_Grabber_DIOT/U_LVDS_repeater (D1B.1 IC20B.6), EEM_Connectors (J3.11)
EEM_IO.LVDS_P20: U_Grabber_DIOT/U_LVDS_repeater (D1A.1 IC20A.6), EEM_Connectors (J3.14)
PGOOD: CPCIS_Connectors (T1.1), Supply (IC27.7 R65.1)
PSU_EN: CPCIS_Connectors (R61.1), Supply (IC27.3 R47.1 R66.1 R67.2)
RX_EN: Grabber_DIOT (R8.2), U_Grabber_DIOT/U_LVDS_repeater (IC20U.3), U_Grabber_DIOT/U_LVDS_repeater (IC20T.3), U_Grabber_DIOT/U_LVDS_repeater (IC20S.3), U_Grabber_DIOT/U_LVDS_repeater (IC20R.3), U_Grabber_DIOT/U_LVDS_repeater (IC20Q.3), U_Grabber_DIOT/U_LVDS_repeater (IC20P.3), U_Grabber_DIOT/U_LVDS_repeater (IC20O.3), U_Grabber_DIOT/U_LVDS_repeater (IC20N.3), U_Grabber_DIOT/U_LVDS_repeater (IC20M.3), U_Grabber_DIOT/U_LVDS_repeater (IC20L.3), U_Grabber_DIOT/U_LVDS_repeater (IC20K.3), U_Grabber_DIOT/U_LVDS_repeater (IC20E.3), U_Grabber_DIOT/U_LVDS_repeater (IC20D.3), U_Grabber_DIOT/U_LVDS_repeater (IC20C.3), U_Grabber_DIOT/U_LVDS_repeater (IC20B.3), U_Grabber_DIOT/U_LVDS_repeater (IC20A.3)
SerRX_N: Grabber_DIOT (J1.19), U_Grabber_DIOT/U_LVDS_repeater (D1K.3 IC20K.1 R131K.1)
SerRX_P: Grabber_DIOT (J1.6), U_Grabber_DIOT/U_LVDS_repeater (D1K.4 IC20K.8 R131K.2)
SerTX_N: Grabber_DIOT (J1.7), U_Grabber_DIOT/U_LVDS_repeater (D1J.6 IC20J.5)
SerTX_P: Grabber_DIOT (J1.20), U_Grabber_DIOT/U_LVDS_repeater (D1J.1 IC20J.6)
SERVMOD_3V3: CPCIS_Connectors (R46.1 R48.2), EEM_Connectors (IC7.5 IC7.6 IC7.12 IC7.13)
TX_EN: Grabber_DIOT (R9.2), U_Grabber_DIOT/U_LVDS_repeater (IC20J.3), U_Grabber_DIOT/U_LVDS_repeater (IC20I.3), U_Grabber_DIOT/U_LVDS_repeater (IC20H.3), U_Grabber_DIOT/U_LVDS_repeater (IC20G.3), U_Grabber_DIOT/U_LVDS_repeater (IC20F.3)
X0_N: Grabber_DIOT (J1.25), U_Grabber_DIOT/U_LVDS_repeater (D1T.3 IC20T.1 R131T.1)
X0_P: Grabber_DIOT (J1.12), U_Grabber_DIOT/U_LVDS_repeater (D1T.4 IC20T.8 R131T.2)
X1_N: Grabber_DIOT (J1.24), U_Grabber_DIOT/U_LVDS_repeater (D1S.3 IC20S.1 R131S.1)
X1_P: Grabber_DIOT (J1.11), U_Grabber_DIOT/U_LVDS_repeater (D1S.4 IC20S.8 R131S.2)
X2_N: Grabber_DIOT (J1.23), U_Grabber_DIOT/U_LVDS_repeater (D1R.3 IC20R.1 R131R.1)
X2_P: Grabber_DIOT (J1.10), U_Grabber_DIOT/U_LVDS_repeater (D1R.4 IC20R.8 R131R.2)
X3_N: Grabber_DIOT (J1.21), U_Grabber_DIOT/U_LVDS_repeater (D1Q.3 IC20Q.1 R131Q.1)
X3_P: Grabber_DIOT (J1.8), U_Grabber_DIOT/U_LVDS_repeater (D1Q.4 IC20Q.8 R131Q.2)
XCLK_N: Grabber_DIOT (J1.22), U_Grabber_DIOT/U_LVDS_repeater (D1U.3 IC20U.1 R131U.1)
XCLK_P: Grabber_DIOT (J1.9), U_Grabber_DIOT/U_LVDS_repeater (D1U.4 IC20U.8 R131U.2)
Y0_N: Grabber_DIOT (J2.25), U_Grabber_DIOT/U_LVDS_repeater (D1O.3 IC20O.1 R131O.1)
Y0_P: Grabber_DIOT (J2.12), U_Grabber_DIOT/U_LVDS_repeater (D1O.4 IC20O.8 R131O.2)
Y1_N: Grabber_DIOT (J2.24), U_Grabber_DIOT/U_LVDS_repeater (D1N.3 IC20N.1 R131N.1)
Y1_P: Grabber_DIOT (J2.11), U_Grabber_DIOT/U_LVDS_repeater (D1N.4 IC20N.8 R131N.2)
Y2_N: Grabber_DIOT (J2.23), U_Grabber_DIOT/U_LVDS_repeater (D1M.3 IC20M.1 R131M.1)
Y2_P: Grabber_DIOT (J2.10), U_Grabber_DIOT/U_LVDS_repeater (D1M.4 IC20M.8 R131M.2)
Y3_N: Grabber_DIOT (J2.21), U_Grabber_DIOT/U_LVDS_repeater (D1L.3 IC20L.1 R131L.1)
Y3_P: Grabber_DIOT (J2.8), U_Grabber_DIOT/U_LVDS_repeater (D1L.4 IC20L.8 R131L.2)
YCLK_N: Grabber_DIOT (J2.22), U_Grabber_DIOT/U_LVDS_repeater (D1P.3 IC20P.1 R131P.1)
YCLK_P: Grabber_DIOT (J2.9), U_Grabber_DIOT/U_LVDS_repeater (D1P.4 IC20P.8 R131P.2)
Z0_N: Grabber_DIOT (J2.19), U_Grabber_DIOT/U_LVDS_repeater (D1D.3 IC20D.1 R131D.1)
Z0_P: Grabber_DIOT (J2.6), U_Grabber_DIOT/U_LVDS_repeater (D1D.4 IC20D.8 R131D.2)
Z1_N: Grabber_DIOT (J2.18), U_Grabber_DIOT/U_LVDS_repeater (D1C.3 IC20C.1 R131C.1)
Z1_P: Grabber_DIOT (J2.5), U_Grabber_DIOT/U_LVDS_repeater (D1C.4 IC20C.8 R131C.2)
Z2_N: Grabber_DIOT (J2.17), U_Grabber_DIOT/U_LVDS_repeater (D1B.3 IC20B.1 R131B.1)
Z2_P: Grabber_DIOT (J2.4), U_Grabber_DIOT/U_LVDS_repeater (D1B.4 IC20B.8 R131B.2)
Z3_N: Grabber_DIOT (J2.15), U_Grabber_DIOT/U_LVDS_repeater (D1A.3 IC20A.1 R131A.1)
Z3_P: Grabber_DIOT (J2.2), U_Grabber_DIOT/U_LVDS_repeater (D1A.4 IC20A.8 R131A.2)
ZCLK_N: Grabber_DIOT (J2.16), U_Grabber_DIOT/U_LVDS_repeater (D1E.3 IC20E.1 R131E.1)
ZCLK_P: Grabber_DIOT (J2.3), U_Grabber_DIOT/U_LVDS_repeater (D1E.4 IC20E.8 R131E.2)

## Assembly variants
DIOT: not fitted J3 J14 J24 R47
EEM: not fitted C9 C10 C11 C12 C13 C14 C15 C16 C17 D5 D6 D7 D8 D9 D10 IC6 IC7 IC8 IC9 J4 J5 R10 R11 R12 R13 R14 R15 R16 R17 R18 R19 R20 R21 R22 R23 R24 R25 R26 R27 R28 R29 R30 R31 R32 R33 R34 R35 R36 R37 R38 R39 R40 R41 R42 R43 R44 R45 R46 R48 R50 R51 R52 R53 R54 R55 R56 R57 R58 R59 R60 R61 R62 R63 R64 R71 T1 T2 T3 T4